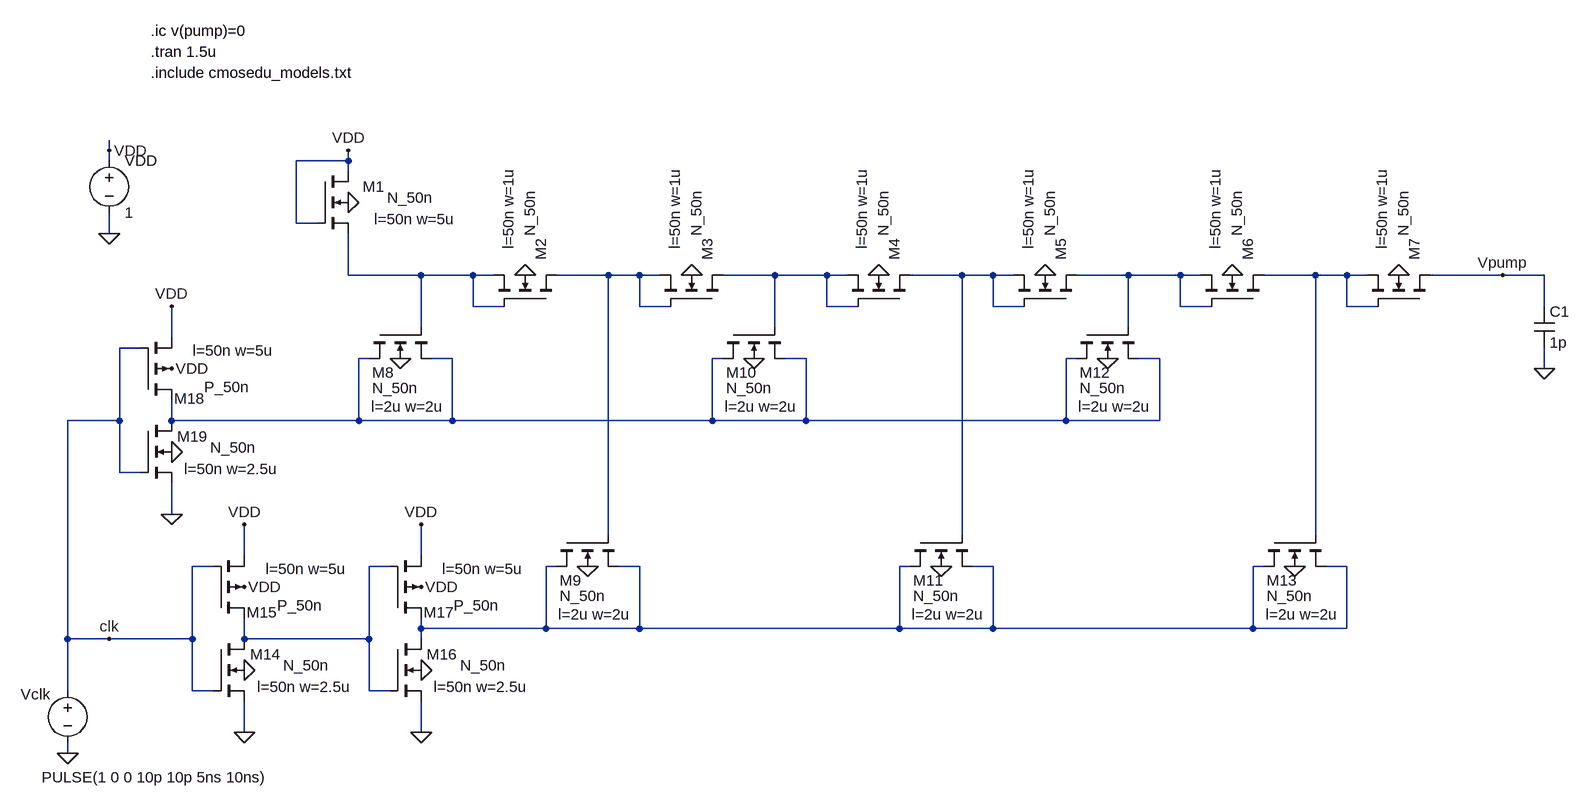
[diagram p0: schematic Fig18_38.asc]
Fig18_38.asc, the LTspice schematic file:
Version 4
SHEET 1 3068 1892
WIRE 320 -720 320 -736
WIRE 320 -704 320 -720
WIRE 688 -704 688 -720
WIRE 688 -704 608 -704
WIRE 688 -688 688 -704
WIRE 608 -608 608 -704
WIRE 640 -608 608 -608
WIRE 320 -592 320 -624
WIRE 688 -528 688 -592
WIRE 800 -528 688 -528
WIRE 880 -528 800 -528
WIRE 912 -528 880 -528
WIRE 1088 -528 1008 -528
WIRE 1136 -528 1088 -528
WIRE 1168 -528 1136 -528
WIRE 1344 -528 1264 -528
WIRE 1424 -528 1344 -528
WIRE 1456 -528 1424 -528
WIRE 1632 -528 1552 -528
WIRE 1680 -528 1632 -528
WIRE 1712 -528 1680 -528
WIRE 1888 -528 1808 -528
WIRE 1968 -528 1888 -528
WIRE 2000 -528 1968 -528
WIRE 2176 -528 2096 -528
WIRE 2224 -528 2176 -528
WIRE 2256 -528 2224 -528
WIRE 2464 -528 2352 -528
WIRE 2528 -528 2464 -528
WIRE 880 -480 880 -528
WIRE 928 -480 880 -480
WIRE 1136 -480 1136 -528
WIRE 1184 -480 1136 -480
WIRE 1424 -480 1424 -528
WIRE 1472 -480 1424 -480
WIRE 1680 -480 1680 -528
WIRE 1728 -480 1680 -480
WIRE 1968 -480 1968 -528
WIRE 2016 -480 1968 -480
WIRE 2224 -480 2224 -528
WIRE 2272 -480 2224 -480
WIRE 2528 -480 2528 -528
WIRE 800 -448 800 -528
WIRE 1344 -448 1344 -528
WIRE 1888 -448 1888 -528
WIRE 416 -432 416 -480
WIRE 368 -416 336 -416
WIRE 720 -400 704 -400
WIRE 848 -400 816 -400
WIRE 1264 -400 1248 -400
WIRE 1392 -400 1360 -400
WIRE 1808 -400 1792 -400
WIRE 1936 -400 1904 -400
WIRE 2528 -384 2528 -416
WIRE 336 -304 336 -416
WIRE 336 -304 256 -304
WIRE 416 -304 416 -336
WIRE 704 -304 704 -400
WIRE 704 -304 416 -304
WIRE 848 -304 848 -400
WIRE 848 -304 704 -304
WIRE 1248 -304 1248 -400
WIRE 1248 -304 848 -304
WIRE 1392 -304 1392 -400
WIRE 1392 -304 1248 -304
WIRE 1792 -304 1792 -400
WIRE 1792 -304 1392 -304
WIRE 1936 -304 1936 -400
WIRE 1936 -304 1792 -304
WIRE 336 -224 336 -304
WIRE 368 -224 336 -224
WIRE 416 -160 416 -208
WIRE 1088 -128 1088 -528
WIRE 1632 -128 1632 -528
WIRE 2176 -128 2176 -528
WIRE 528 -96 528 -144
WIRE 800 -96 800 -144
WIRE 480 -80 448 -80
WIRE 752 -80 720 -80
WIRE 1008 -80 992 -80
WIRE 1136 -80 1104 -80
WIRE 1552 -80 1536 -80
WIRE 1680 -80 1648 -80
WIRE 2096 -80 2080 -80
WIRE 2224 -80 2192 -80
WIRE 800 16 800 0
WIRE 992 16 992 -80
WIRE 992 16 800 16
WIRE 1136 16 1136 -80
WIRE 1136 16 992 16
WIRE 1536 16 1536 -80
WIRE 1536 16 1136 16
WIRE 1680 16 1680 -80
WIRE 1680 16 1536 16
WIRE 2080 16 2080 -80
WIRE 2080 16 1680 16
WIRE 2224 16 2224 -80
WIRE 2224 16 2080 16
WIRE 256 32 256 -304
WIRE 320 32 256 32
WIRE 448 32 448 -80
WIRE 448 32 320 32
WIRE 528 32 528 0
WIRE 720 32 720 -80
WIRE 720 32 528 32
WIRE 800 32 800 16
WIRE 256 112 256 32
WIRE 448 112 448 32
WIRE 480 112 448 112
WIRE 720 112 720 32
WIRE 752 112 720 112
WIRE 528 176 528 128
WIRE 800 176 800 128
WIRE 256 208 256 192
FLAG 256 208 0
FLAG 416 -256 0
FLAG 320 -592 0
FLAG 320 -720 VDD
FLAG 416 -384 VDD
FLAG 416 -160 0
FLAG 416 -480 VDD
FLAG 688 -640 0
FLAG 960 -528 0
FLAG 688 -720 VDD
FLAG 1216 -528 0
FLAG 1504 -528 0
FLAG 1760 -528 0
FLAG 2048 -528 0
FLAG 2304 -528 0
FLAG 2528 -384 0
FLAG 768 -400 0
FLAG 1056 -80 0
FLAG 1312 -400 0
FLAG 1600 -80 0
FLAG 1856 -400 0
FLAG 2144 -80 0
FLAG 528 80 0
FLAG 528 -48 VDD
FLAG 528 176 0
FLAG 528 -144 VDD
FLAG 800 80 0
FLAG 800 -48 VDD
FLAG 800 176 0
FLAG 800 -144 VDD
FLAG 2464 -528 Vpump
FLAG 320 32 clk
SYMBOL nmos4 368 -304 R0
WINDOW 0 104 24 Right 2
WINDOW 3 179 41 Right 2
WINDOW 123 213 74 Right 2
SYMATTR InstName M19
SYMATTR Value N_50n
SYMATTR Value2 l=50n w=2.5u
SYMBOL voltage 256 96 R0
WINDOW 0 -72 21 Left 2
WINDOW 3 -40 149 Left 2
WINDOW 123 0 0 Left 2
WINDOW 39 0 0 Left 2
SYMATTR InstName Vclk
SYMATTR Value PULSE(1 0 0 10p 10p 5ns 10ns)
SYMBOL voltage 320 -720 R0
WINDOW 123 0 0 Left 2
WINDOW 39 0 0 Left 2
SYMATTR InstName VDD
SYMATTR Value 1
SYMBOL pmos4 368 -336 M180
WINDOW 0 99 2 Right 2
WINDOW 3 168 20 Right 2
WINDOW 123 206 76 Right 2
SYMATTR InstName M18
SYMATTR Value P_50n
SYMATTR Value2 l=50n w=5u
SYMBOL nmos4 640 -688 R0
WINDOW 0 104 24 Right 2
WINDOW 3 179 41 Right 2
WINDOW 123 213 74 Right 2
SYMATTR InstName M1
SYMATTR Value N_50n
SYMATTR Value2 l=50n w=5u
SYMBOL nmos4 1008 -480 M270
WINDOW 0 104 24 Right 2
WINDOW 3 179 41 Right 2
WINDOW 123 213 74 Right 2
SYMATTR InstName M2
SYMATTR Value N_50n
SYMATTR Value2 l=50n w=1u
SYMBOL nmos4 1264 -480 M270
WINDOW 0 104 24 Right 2
WINDOW 3 179 41 Right 2
WINDOW 123 213 74 Right 2
SYMATTR InstName M3
SYMATTR Value N_50n
SYMATTR Value2 l=50n w=1u
SYMBOL nmos4 1552 -480 M270
WINDOW 0 104 24 Right 2
WINDOW 3 179 41 Right 2
WINDOW 123 213 74 Right 2
SYMATTR InstName M4
SYMATTR Value N_50n
SYMATTR Value2 l=50n w=1u
SYMBOL nmos4 1808 -480 M270
WINDOW 0 104 24 Right 2
WINDOW 3 179 41 Right 2
WINDOW 123 213 74 Right 2
SYMATTR InstName M5
SYMATTR Value N_50n
SYMATTR Value2 l=50n w=1u
SYMBOL nmos4 2096 -480 M270
WINDOW 0 104 24 Right 2
WINDOW 3 179 41 Right 2
WINDOW 123 213 74 Right 2
SYMATTR InstName M6
SYMATTR Value N_50n
SYMATTR Value2 l=50n w=1u
SYMBOL nmos4 2352 -480 M270
WINDOW 0 104 24 Right 2
WINDOW 3 179 41 Right 2
WINDOW 123 213 74 Right 2
SYMATTR InstName M7
SYMATTR Value N_50n
SYMATTR Value2 l=50n w=1u
SYMBOL cap 2512 -480 R0
SYMATTR InstName C1
SYMATTR Value 1p
SYMBOL nmos4 720 -448 M90
WINDOW 0 70 5 VRight 2
WINDOW 3 94 5 VRight 2
WINDOW 123 122 3 VRight 2
SYMATTR InstName M8
SYMATTR Value N_50n
SYMATTR Value2 l=2u w=2u
SYMBOL nmos4 1008 -128 M90
WINDOW 0 70 5 VRight 2
WINDOW 3 94 5 VRight 2
WINDOW 123 122 3 VRight 2
SYMATTR InstName M9
SYMATTR Value N_50n
SYMATTR Value2 l=2u w=2u
SYMBOL nmos4 1264 -448 M90
WINDOW 0 70 5 VRight 2
WINDOW 3 94 5 VRight 2
WINDOW 123 122 3 VRight 2
SYMATTR InstName M10
SYMATTR Value N_50n
SYMATTR Value2 l=2u w=2u
SYMBOL nmos4 1552 -128 M90
WINDOW 0 70 5 VRight 2
WINDOW 3 94 5 VRight 2
WINDOW 123 122 3 VRight 2
SYMATTR InstName M11
SYMATTR Value N_50n
SYMATTR Value2 l=2u w=2u
SYMBOL nmos4 1808 -448 M90
WINDOW 0 70 5 VRight 2
WINDOW 3 94 5 VRight 2
WINDOW 123 122 3 VRight 2
SYMATTR InstName M12
SYMATTR Value N_50n
SYMATTR Value2 l=2u w=2u
SYMBOL nmos4 2096 -128 M90
WINDOW 0 70 5 VRight 2
WINDOW 3 94 5 VRight 2
WINDOW 123 122 3 VRight 2
SYMATTR InstName M13
SYMATTR Value N_50n
SYMATTR Value2 l=2u w=2u
SYMBOL nmos4 480 32 R0
WINDOW 0 104 24 Right 2
WINDOW 3 179 41 Right 2
WINDOW 123 213 74 Right 2
SYMATTR InstName M14
SYMATTR Value N_50n
SYMATTR Value2 l=50n w=2.5u
SYMBOL pmos4 480 0 M180
WINDOW 0 99 9 Right 2
WINDOW 3 168 20 Right 2
WINDOW 123 206 76 Right 2
SYMATTR InstName M15
SYMATTR Value P_50n
SYMATTR Value2 l=50n w=5u
SYMBOL nmos4 752 32 R0
WINDOW 0 104 24 Right 2
WINDOW 3 179 41 Right 2
WINDOW 123 213 74 Right 2
SYMATTR InstName M16
SYMATTR Value N_50n
SYMATTR Value2 l=50n w=2.5u
SYMBOL pmos4 752 0 M180
WINDOW 0 99 9 Right 2
WINDOW 3 168 20 Right 2
WINDOW 123 206 76 Right 2
SYMATTR InstName M17
SYMATTR Value P_50n
SYMATTR Value2 l=50n w=5u
TEXT 384 -872 Left 2 !.tran 1.5u
TEXT 384 -840 Left 2 !.include cmosedu_models.txt
TEXT 384 -904 Left 2 !.ic v(pump)=0

The netlist it stands for:
* Fig18_38.asc
M19 N007 clk 0 0 N_50n l=50n w=2.5u
Vclk clk 0 PULSE(1 0 0 10p 10p 5ns 10ns)
VDD VDD 0 1
M18 N007 clk VDD VDD P_50n l=50n w=5u
M1 VDD VDD N001 0 N_50n l=50n w=5u
M2 N002 N001 N001 0 N_50n l=50n w=1u
M3 N003 N002 N002 0 N_50n l=50n w=1u
M4 N004 N003 N003 0 N_50n l=50n w=1u
M5 N005 N004 N004 0 N_50n l=50n w=1u
M6 N006 N005 N005 0 N_50n l=50n w=1u
M7 Vpump N006 N006 0 N_50n l=50n w=1u
C1 Vpump 0 1p
M8 N007 N001 N007 0 N_50n l=2u w=2u
M9 N009 N002 N009 0 N_50n l=2u w=2u
M10 N007 N003 N007 0 N_50n l=2u w=2u
M11 N009 N004 N009 0 N_50n l=2u w=2u
M12 N007 N005 N007 0 N_50n l=2u w=2u
M13 N009 N006 N009 0 N_50n l=2u w=2u
M14 N008 clk 0 0 N_50n l=50n w=2.5u
M15 N008 clk VDD VDD P_50n l=50n w=5u
M16 N009 N008 0 0 N_50n l=50n w=2.5u
M17 N009 N008 VDD VDD P_50n l=50n w=5u
.model NMOS NMOS
.model PMOS PMOS
.lib standard.mos
.tran 1.5u
.include cmosedu_models.txt
.ic v(pump)=0
.backanno
.end